# EAGLE design cubex_power (EAGLE 6.5.0)
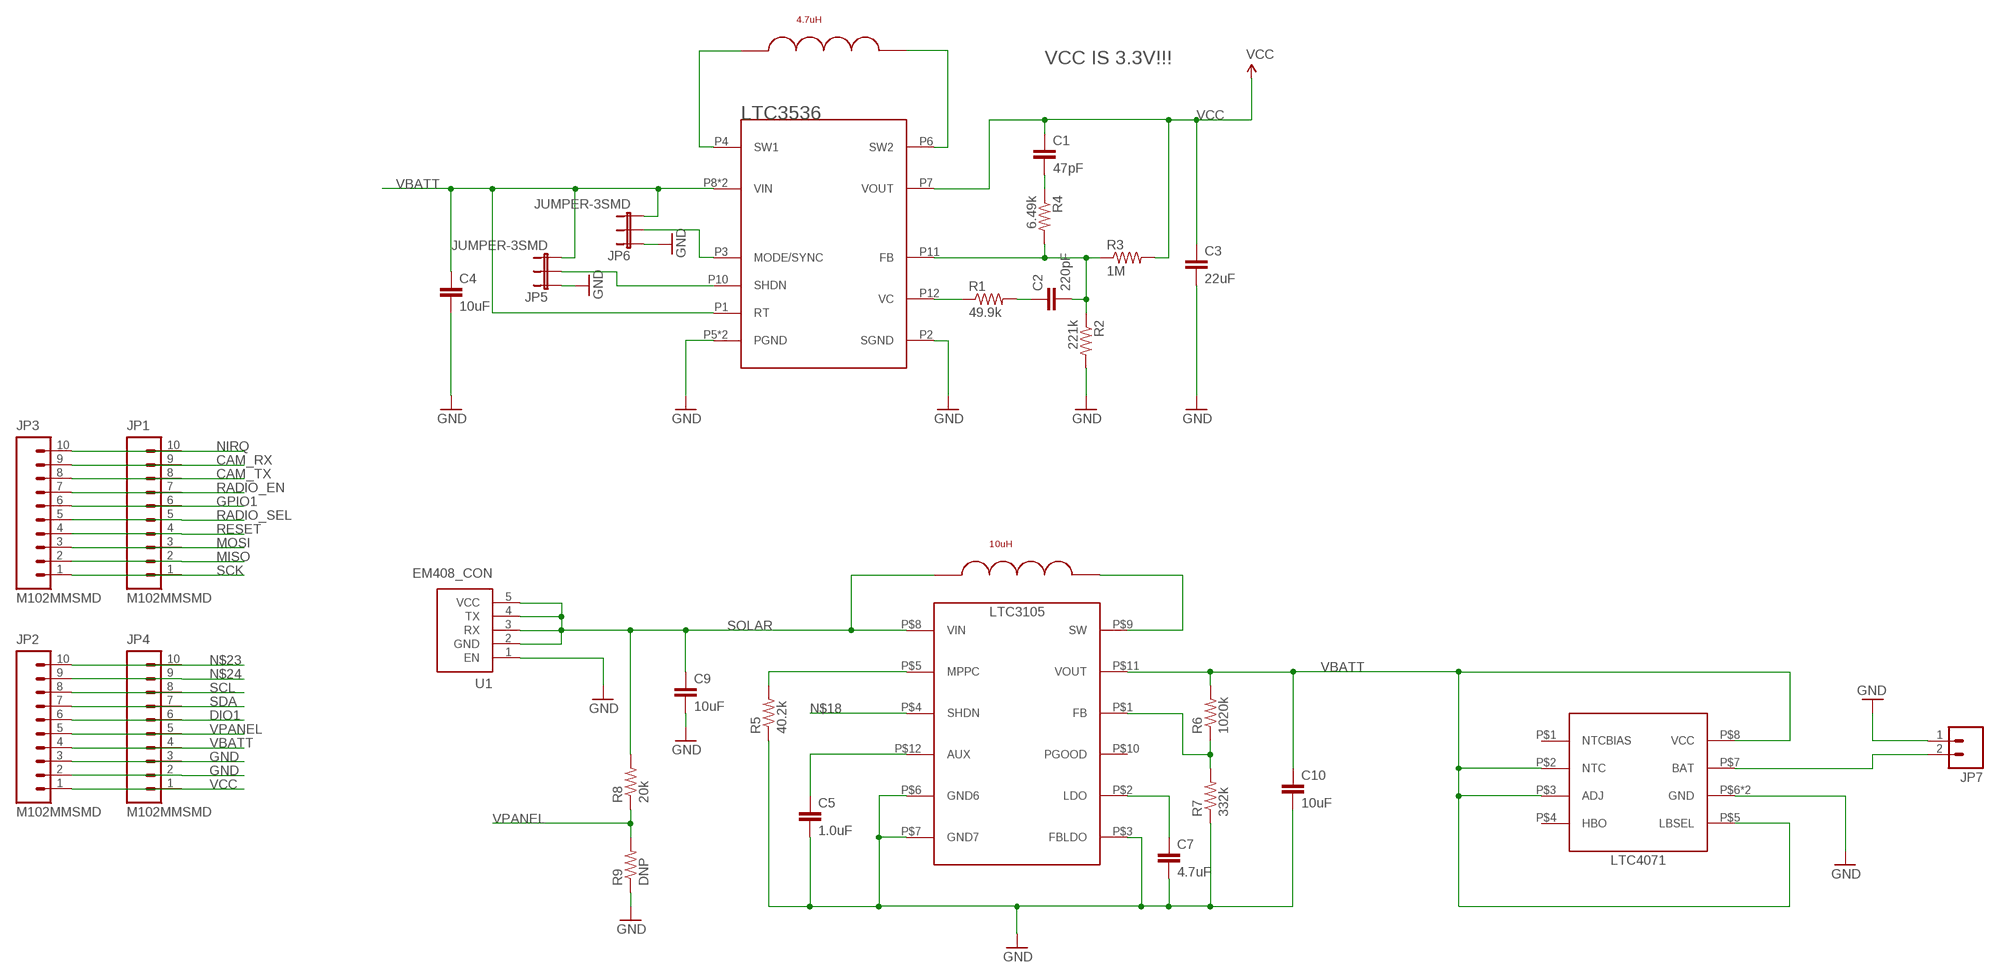
[diagram p0: schematic, sheet 1]

## Parts
C1  47pF  CAP1206  [1206]
C2  220pF  CAP1206  [1206]
C3  22uF  CAP1206  [1206]
C4  10uF  CAP1206  [1206]
C5  1.0uF  1.0UF-25V-+80/-20(0805)  [0805]
C7  4.7uF  CAP0805  [0805]
C9  10uF  CAP1206  [1206]
C10  10uF  CAP1206  [1206]
JP1  M102MMSMD  [1X10-2MM-SMD]
JP2  M102MMSMD  [1X10-2MM-SMD]
JP3  M102MMSMD  [1X10-2MM-SMD]
JP4  M102MMSMD  [1X10-2MM-SMD]
JP5  JUMPER-3SMD  [SJ_3]
JP6  JUMPER-3SMD  [SJ_3]
JP7  M02JST-PTH-2  [JST-2-PTH]
R1  49.9k  RESISTOR1206  [1206]
R2  221k  RESISTOR1206  [1206]
R3  1M  RESISTOR1206  [1206]
R4  6.49k  RESISTOR1206  [1206]
R5  40.2k  RESISTOR0805-RES  [0805]
R6  1020k  RESISTOR0805-RES  [0805]
R7  332k  RESISTOR0805-RES  [0805]
R8  20k  RESISTOR0805-RES  [0805]
R9  DNP  RESISTOR0805-RES  [0805]
U1  EM408_CON  [EM408_CON]
U$1  LTC3105  [LTC3105]
U$2  4.7uH  STEVESCOILCRAFT_COILCRAFT_LPS4018  [STEVESCOILCRAFT_COILCRAFT_LPS4018]
U$3  LTC3536  [LTC3536-MSE]
U$4  10uH  STEVESCOILCRAFT_COILCRAFT_LPS4018  [STEVESCOILCRAFT_COILCRAFT_LPS4018]
U$5  LTC4071  [LTC4071]

## Nets
CAM_RX: JP1.9 JP3.9
CAM_TX: JP1.8 JP3.8
DIO1: JP2.6 JP4.6
GND: C3.2 C4.2 C5.2 C7.2 C9.2 C10.2 JP2.2 JP2.3 JP4.2 JP4.3 JP5.1 JP6.1 JP7.1 R2.2 R5.1 R7.1 R9.1 U1.1(EN) U$1.P$3(FBLDO) U$1.P$6(GND6) U$1.P$7(GND7) U$3.P2(SGND) U$3.P5(PGND) U$3.P13(PGND) U$5.P$6(GND) U$5.P$9(GND)
GPIO1: JP1.6 JP3.6
MISO: JP1.2 JP3.2
MOSI: JP1.3 JP3.3
N$1: JP7.2 U$5.P$7(BAT)
N$2: U$2.P$2 U$3.P6(SW2)
N$3: U$2.P$1 U$3.P4(SW1)
N$4: C1.2 R4.1
N$6: C2.2 R2.1 R3.1 R4.2 U$3.P11(FB)
N$9: R1.1 U$3.P12(VC)
N$10: C2.1 R1.2
N$11: JP5.2 U$3.P10(SHDN)
N$14: JP6.2 U$3.P3(MODE/SYNC)
N$16: R5.2 U$1.P$5(MPPC)
N$17: C5.1 U$1.P$12(AUX)
N$18: U$1.P$4(SHDN)
N$19: R6.1 R7.2 U$1.P$1(FB)
N$22: C7.1 U$1.P$2(LDO)
N$23: JP2.10 JP4.10
N$24: JP2.9 JP4.9
N$26: U$1.P$9(SW) U$4.P$2
NIRQ: JP1.10 JP3.10
RADIO_EN: JP1.7 JP3.7
RADIO_SEL: JP1.5 JP3.5
RESET: JP1.4 JP3.4
SCK: JP1.1 JP3.1
SCL: JP2.8 JP4.8
SDA: JP2.7 JP4.7
SOLAR: C9.1 R8.2 U1.2(GND) U1.3(RX) U1.4(TX) U1.5(VCC) U$1.P$8(VIN) U$4.P$1
VBATT: C4.1 C10.1 JP2.4 JP4.4 JP5.3 JP6.3 R6.2 U$1.P$11(VOUT) U$3.P1(RT) U$3.P8(VIN) U$3.P9(VIN) U$5.P$2(NTC) U$5.P$3(ADJ) U$5.P$5(LBSEL) U$5.P$8(VCC)
VCC: C1.1 C3.1 JP2.1 JP4.1 R3.2 U$3.P7(VOUT)
VPANEL: JP2.5 JP4.5 R8.1 R9.2
Unconnected: U$1.P$10(PGOOD) U$5.P$1(NTCBIAS) U$5.P$4(HBO)

## Notes on the sheet
- VCC IS 3.3V!!!

## Library data of the parts
C1-C4 = SparkFun:CAP: Capacitor Standard 0603 ceramic capacitor, and 0.1" leaded capacitor.
C5 = SparkFun-Capacitors:1.0UF-25V-+80/-20(0805); PROD_ID: CAP-11625
C7 C9 C10 = SparkFun-Capacitors:CAP: Capacitor Standard 0603 ceramic capacitor, and 0.1" leaded capacitor.
JP1-JP4 = SparkFun:M10: Header 10 Standard 10-pin 0.1" header. Use with straight break away headers (SKU : PRT-00116), right angle break away headers (PRT-00553), swiss pins (PRT-00743), machine pins (PRT-00117), and female headers (PRT-00115).
JP5 JP6 = SparkFun:JUMPER-3
JP7 = SparkFun:M02: Header 2 Standard 2-pin 0.1" header. Use with straight break away headers (SKU : PRT-00116), right angle break away headers (PRT-00553), swiss pins (PRT-00743), machine pins (PRT-00117), and female headers (PRT-00115). Molex polarized connector foot print use with SKU : PRT-08233 with associated crimp pins and housings.
R1-R4 = SparkFun:RESISTOR: Resistor Basic schematic elements and footprints for 0603, 1206, and PTH resistors.
R5-R9 = SparkFun-Resistors:RESISTOR: Resistor Basic schematic elements and footprints for 0603, 1206, and PTH resistors.
U1 = SparkFun:EM408_CON: This is the mating connector for the EM408 GPS receiver. The EM408 connects to the board via a cable, this connector footprint does not include the outline of the receiver. You should include the "EM408_Outline" device in your schematic if you are to use the EM408 in your design.
U$1 = arko:LTC3105
U$2 U$4 = picoAVA-R9:STEVESCOILCRAFT_COILCRAFT_LPS4018: CoilCraft LPS4018 series inductor
U$3 = arko:LTC3536
U$5 = arko:LTC4071

## Board
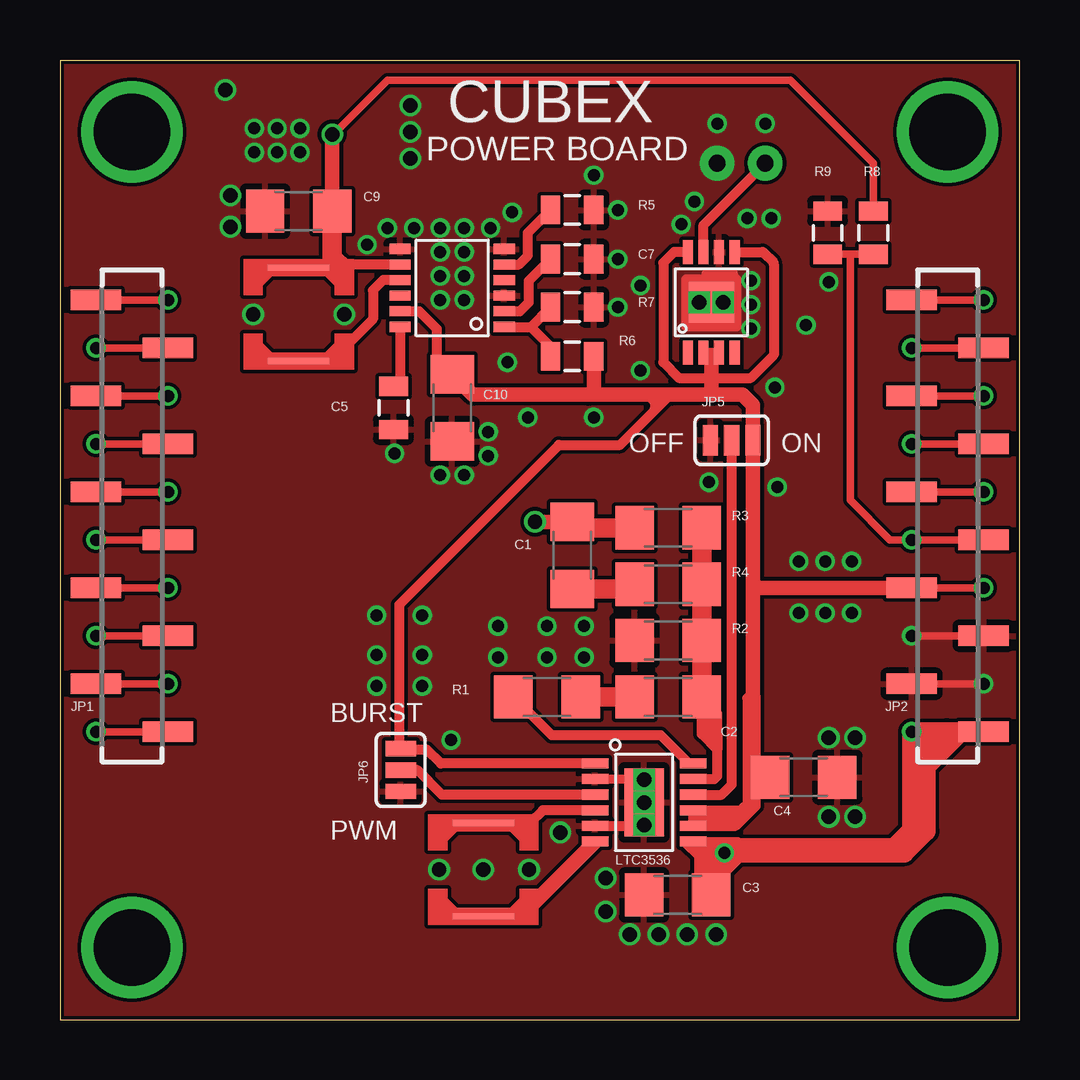
[diagram p1: board, top side]
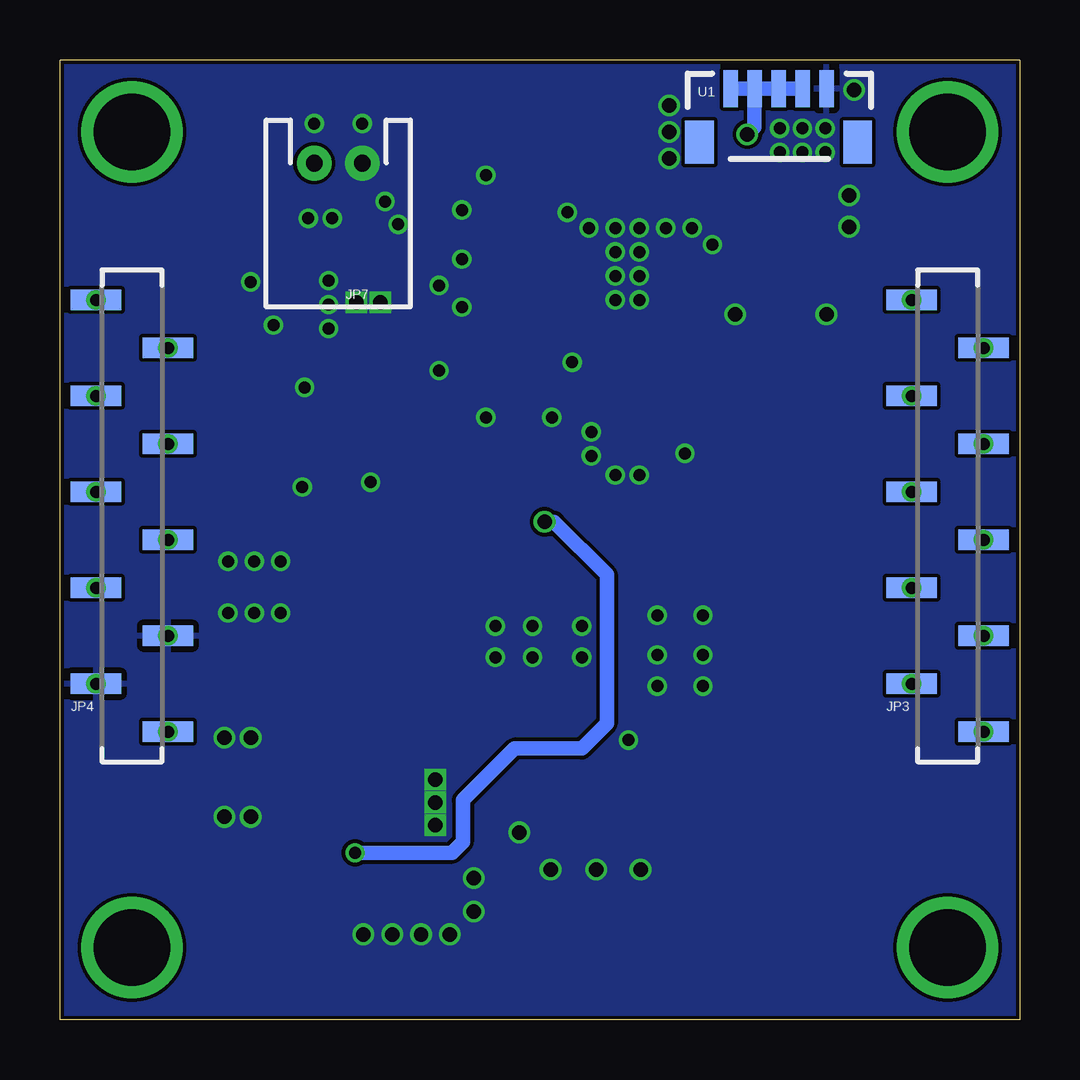
[diagram p2: board, bottom side, seen from below]

Size 40 x 40 mm. Coordinates in mm from the lower left corner, seen from the top.
Outline: 0,0 40,0 40,40 0,40 0,0
Copper layers (1*16): Top 0.035mm / dielectric 1.5mm / Bottom 0.035mm
Design rules "hackvana": minimum track width 6mil, minimum drill 0.3mm, track to track 6mil, track to pad 6mil, pad to pad 6mil, via to via 6mil, smd to smd 0mil, copper to edge 6mil, drill to drill 6mil, minimum pad ring 10mil, minimum via ring 6mil, stop-mask expansion 2mil, vias tented up to drill 100mil, thermal gap 10mil

### Footprints (pad centres in the part's own frame; a part is rotated, then mirrored left to right if it is on the bottom)
1206 = smd 1.6 x 1.8: 1 -1.4,0; 2 1.4,0
0805 = smd 0.8 x 1.2: 1 -0.9,0; 2 0.9,0
1X10-2MM-SMD = smd 0.85 x 2.1: 1 0,-1.5; 2 2,1.5; 3 4,-1.5; 4 6,1.5; 5 8,-1.5; 6 10,1.5; 7 12,-1.5; 8 14,1.5; 9 16,-1.5; 10 18,1.5
SJ_3 = smd 0.635 x 1.27: 1 -0.889,0; 2 0,0; 3 0.889,0
JST-2-PTH = drill 0.7 pad 1.448: 1 -1,0; 2 1,0
EM408_CON = smd 0.6 x 1.55: 1 4,0; 2 3,0; 3 2,0; 4 1,0; 5 0,0 | smd 1.2 x 1.8: P$1 -1.3,-2.225; P$2 5.3,-2.225
LTC3105 = smd 0.42 x 0.889: P$1 -1.625,-2.171; P$2 -0.975,-2.171; P$3 -0.325,-2.171; P$4 0.325,-2.171; P$5 0.975,-2.171; P$6 1.625,-2.171; P$7 1.625,2.171; P$8 0.975,2.171; P$9 0.325,2.171; P$10 -0.325,2.171; P$11 -0.975,2.171; P$12 -1.625,2.171
STEVESCOILCRAFT_COILCRAFT_LPS4018 = smd 0.254 x 2.54: P$1 -1.95,0; P$2 1.95,0
LTC3536-MSE = smd 0.42 x 1.1: P1 -1.625,-2.045; P2 -0.975,-2.045; P3 -0.325,-2.045; P4 0.325,-2.045; P5 0.975,-2.045; P6 1.625,-2.045; P7 1.625,2.045; P8 0.975,2.045; P9 0.325,2.045; P10 -0.325,2.045; P11 -0.975,2.045; P12 -1.625,2.045 | smd 2.845 x 1.651: P13 0,0
LTC4071 = smd 0.42 x 1: P$1 -0.975,-2.1; P$2 -0.325,-2.1; P$3 0.325,-2.1; P$4 0.975,-2.1; P$5 0.975,2.1; P$6 0.325,2.1; P$7 -0.325,2.1; P$8 -0.975,2.1 | smd 1.88 x 1.68: P$9 0,0

### Placement (x,y rotation side)
C1  21.35,19.35 270 top
C2  25.35,13.45 0 top
C3  25.75,5.2 180 top
C4  31,10.1 0 top
C5  13.9,25.5 270 top
C7  21.35,31.7 0 top
C9  9.95,33.7 180 top
C10  16.35,25.5 270 top
JP1  3,12 90 top
JP2  37,12 90 top
JP3  3,12 90 bottom
JP4  37,12 90 bottom
JP5  28,24.15 0 top
JP6  14.2,10.4 90 top
JP7  28.4,35.7 180 bottom
R1  20.3,13.45 0 top
R2  25.35,15.8 180 top
R3  25.35,20.5 180 top
R4  25.35,18.15 0 top
R5  21.35,33.75 180 top
R6  21.35,27.65 0 top
R7  21.35,29.7 180 top
R8  33.9,32.8 90 top
R9  32,32.8 270 top
U1  12.05,38.8 0 bottom
U$1  16.35,30.5 90 top
U$2  17.65,6.25 270 top
U$3  24.35,9.05 270 top
U$4  9.95,29.4 270 top
U$5  27.15,29.9 0 top

### Tracks (layer width: path | path; a pad name or v marks a point on that pad's centre or on a via)
CAM_RX  (via drill 0.5)
  Top 0.305: JP1.9 JP3.9
  other vias: 1.5,28
CAM_TX  (via drill 0.5)
  Top 0.305: JP1.8 JP3.8
  other vias: 4.5,26
DIO1  (via drill 0.5)
  Top 0.305: JP2.6 JP4.6
  other vias: 38.5,22
GND  (via drill 0.5, 0.6)
  Top 0.254: 22.25,8.1 22.3,8.1 | 22.3,8.1 22.4,8.1 | U$3.P5 22.3,8.1
  Top 0.305: JP2.2 JP4.2 | JP2.3 JP4.3 | 22.2,10 22.33,10 | 22.35,10 22.85,10 | 23.7,10 22.85,10 | 22.85,10 22.8,10.05 | 22.8,10.05 24.1,10.05 24.35,10.05 | 22.8,10.05 22.4,10.05 22.35,10 | 22.35,10 22.33,10 | 22.33,10 U$3.P2
  Top 0.406: 24.3,10 v24.35,10 24.05,10 | U$3.P5 24.35,8.07 v24.35,8.1 | 23.9,10 24.05,10 | 24.05,10 24.1,10.05 | 26.3,30.85 26.1,30.85 26.1,28.9 28.2,28.9 28.2,30.85 28.05,30.85 | 28.05,30.85 26.4,30.85 26.65,30.6 v26.65,29.9 | 26.95,31.1 28.05,31.1 28.05,30.85
  other vias: 38.5,14 35.5,16 24.35,9.05 32.05,11.75 33.15,11.75 33.15,8.45 32.05,8.45 22.75,5.9 22.75,4.5 23.75,3.55 24.95,3.55 26.15,3.55 27.35,3.55 20.85,7.8 19.55,6.25 17.65,6.25 15.8,6.25 31.9,16.95 30.8,16.95 26.45,34.1 33,16.95 20.3,16.4 21.85,16.4 21.85,15.1 20.3,15.1 29.9,22.2 16.85,33 15.85,33 16.85,31 24.2,27.05 16.85,32 28.65,33.4 29.65,33.4 25.9,33.15 14.6,35.9 14.6,38.1 14.6,37 6.9,38.75 7.1,34.35 7.1,33.05 8.05,29.4 11.85,29.4 8.1,37.15 9.05,37.15 10,37.15 10,36.15 9.05,36.15 8.1,36.15 15.85,30 16.85,30 14.75,33 15.85,31 12.8,32.3 15.85,32 30.8,19.1 31.9,19.1 33,19.1 22.25,25.1 23.25,33.75 15.85,22.7 17.95,33 18.65,27.4 19.5,25.1 13.95,23.6 17.85,23.5 17.85,24.5 16.85,22.7 18.85,33.65 13.65,33 23.25,29.7 23.25,31.7 15.1,15.2 13.2,15.2 27.65,29.9 13.2,13.9 13.2,16.85 15.1,16.85 15.1,13.9 16.3,11.65 18.25,15.1 18.25,16.4 27.05,22.4 29.8,26.35 31.1,28.95 32.05,30.75 29.4,37.35 27.4,37.35 22.25,35.2 24.2,30.6 28.8,29.8 28.8,28.8 28.8,30.8
  pour Top: 0,40 40,40 40,0 0,0
  pour Bottom: 0,40 40,40 40,0 0,0
GPIO1  (via drill 0.5)
  Top 0.305: JP1.6 JP3.6
  other vias: 4.5,22
MISO  (via drill 0.5)
  Top 0.305: JP1.2 JP3.2
  other vias: 4.5,14
MOSI  (via drill 0.5)
  Top 0.305: JP1.3 JP3.3
  other vias: 1.5,16
N$1
  Top 0.406: U$5.P$7 26.82,33.12 JP7.2
N$2
  Top 0.254: 22.45,7.4 22.33,7.4 U$3.P6
  Top 0.406: U$3.P6 22.18,7.42 19.8,5.05 19.65,5.05 19.5,4.9 19.5,4.35 19.45,4.3 U$2.P$2 | 22.45,7.4 19.7,4.65
N$3
  Top 0.406: U$3.P4 20.12,8.72 19.6,8.2 U$2.P$1
N$4
  Top 0.813: C1.2 23.75,17.95 R4.1
N$5  (via drill 3.2)
  other vias: 3,3
N$6
  Top 0.406: U$3.P11 27.27,10.03 27.4,10.15 27.4,11.25 | 27.4,11.25 26.75,11.9 | 26.75,11.9 27.4,11.9 | 27.4,11.9 27.4,11.25 | 27.05,12.8 27.05,12.2 27.2,12.05 26.9,12.05 26.75,11.9 | 26.75,11.9 C2.2 | 27.4,11.9 27.4,12.45 | 27.4,12.45 27.4,12.75 27.35,12.8 27.05,12.8 | 27.4,12.45 27.05,12.8
  Top 0.813: C2.2 R2.1 R4.2 R3.1
N$7  (via drill 3.2)
  other vias: 37,3
N$8  (via drill 3.2)
  other vias: 37,37
N$9
  Top 0.406: R1.1 20.5,11.85 25.05,11.85 26.23,10.68 U$3.P12
N$10
  Top 0.813: R1.2 C2.1
N$11
  Top 0.406: U$3.P10 27.57,9.38 28,9.8 JP5.2
N$12  (via drill 3.2)
  other vias: 3,37
N$14
  Top 0.406: U$3.P3 15.93,9.38 14.9,10.4 JP6.2
N$16
  Top 0.406: U$1.P$5 19.12,31.48 19.5,31.85 19.5,32.8 R5.2
N$17
  Top 0.406: U$1.P$12 14.18,26.68 C5.1
N$19
  Top 0.406: U$1.P$1 19.62,28.88 | 19.62,28.88 R7.2 | R6.1 20.45,28.05 19.62,28.88
N$22
  Top 0.406: U$1.P$2 19.18,29.52 19.55,29.9 19.55,30.8 C7.1
N$23  (via drill 0.5)
  Top 0.305: JP2.10 JP4.10
  other vias: 38.5,30
N$24  (via drill 0.5)
  Top 0.305: JP2.9 JP4.9
  other vias: 35.5,28
N$26
  Top 0.406: U$1.P$9 13.47,30.82 13.05,30.4 13.05,29.2 11.4,27.55 10.05,27.55 U$4.P$2
NIRQ  (via drill 0.5)
  Top 0.305: JP1.10 JP3.10
  other vias: 4.5,30
RADIO_EN  (via drill 0.5)
  Top 0.305: JP1.7 JP3.7
  other vias: 1.5,24
RADIO_SEL  (via drill 0.5)
  Top 0.305: JP1.5 JP3.5
  other vias: 1.5,20
RESET  (via drill 0.5)
  Top 0.305: JP1.4 JP3.4
  other vias: 4.5,18
SCK  (via drill 0.5)
  Top 0.305: JP1.1 JP3.1
  other vias: 1.5,12
SCL  (via drill 0.5)
  Top 0.305: JP2.8 JP4.8
  other vias: 38.5,26
SDA  (via drill 0.5)
  Top 0.305: JP2.7 JP4.7
  other vias: 35.5,24
SOLAR  (via drill 0.6)
  Top 0.305: v11.35,36.9 11.4,36.9 13.65,39.15 30.45,39.15 33.9,35.7 R8.2
  Top 0.406: U$1.P$8 11.65,31.48 10.07,31.48 U$4.P$1
  Top 0.61: v11.35,36.9 C9.1
  Top 0.813: C9.1 11.35,31.77 11.65,31.48
  Bottom 0.61: U1.2 U1.3 U1.4 | U1.4 U1.5 | U1.4 11.05,37.2 v11.35,36.9
VBATT  (via drill 0.5)
  Top 0.305: JP2.4 JP4.4 | U$5.P$5 29.25,32 29.75,31.5
  Top 0.406: 28.8,8.7 28.18,8.07 U$3.P8 U$3.P9 28.77,8.72 28.8,8.7 | 28.8,8.7 26.85,8.7 26.6,8.45 28.35,8.45 28.4,8.5 28.6,8.5 29,8.9 29,10.1 | 29,10.1 29,13.45 28.85,13.45 28.7,13.45 28.65,13.4 28.65,9 28.45,8.8 28.65,8.8 28.9,9.05 28.9,10 | 28.9,10 28.9,13.25 28.85,13.3 | 14.24,11.25 15.3,11.25 15.88,10.68 U$3.P1 | 14.24,11.25 JP6.3 | 14.24,11.25 14.15,11.25 14.15,17.3 20.8,23.95 23.35,23.95 25.45,26.05 | 28.9,10 29,10.1 | 29,10.1 C4.1 | U$1.P$11 14.97,29.52 15.7,28.8 15.7,27.55 C10.1 | 24.65,25.9 24.85,25.7 | 24.85,25.7 24.8,25.7 24.8,25.45 | 24.85,25.7 25.2,26.05 25.15,26.1 | U$5.P$8 25.6,32 25.15,31.55 25.15,27.4 25.8,26.75 27.15,26.75 28.8,26.75 29.75,27.7 29.75,31.5 | 27.15,27.45 27.48,27.77 U$5.P$3 U$5.P$2 27,27.8 27.15,27.65 | U$5.P$5 29.3,32 29.75,31.55
  Top 0.61: 28.89,18.2 JP5.3 28.89,25.61 28.45,26.05 27.2,26.05 | 28.89,18.2 28.89,13.49 28.85,13.45 | JP2.4 29.09,18 28.89,18.2 | 27.2,26.05 25.45,26.05 25.2,26.05 22.05,26.05 | 22.05,26.05 17.2,26.05 C10.1 | R6.2 22.25,26.25 22.05,26.05 | 27.15,27.65 27.15,26.75 27.15,26.1 27.2,26.05
  other vias: 38.5,18
VCC  (via drill 0.5, 0.6)
  Top 0.305: v27.7,6.95 27.7,7.35 27.75,7.4
  Top 0.406: 26.85,7.05 26.9,7.05 26.9,7.35 26.95,7.4 27.75,7.4 28.25,7.4 28.45,7.2 28.45,7.15 28.35,7.05 | 26.85,7.05 26.77,7.05 U$3.P7 | 26.85,7.05 26.85,6.8 26.65,6.6 26.65,6.8 26.1,7.35 26.75,7.35 27.2,6.9
  Top 0.61: 28.35,7.05 27.5,7.05 26.9,7.05 26.9,7.3 | C1.1 v19.8,20.75
  Top 0.813: 27.5,6.2 27.5,7.05 | 26.85,7.05 26.85,5.6 27,5.6 27,5.2 C3.1 27.5,5.2 27.5,6.2 | 27.5,6.2 28.3,7 27.4,7 27.35,6.95 | C1.1 21.6,20.5 R3.2 | 28.35,7.05 28.15,7.05 28.05,7.15 34.75,7.15 35.5,7.9 JP4.1 | 27.75,6.95 35.2,6.95 36.1,7.85 36.1,11.4 JP4.1 | JP4.1 36.95,12 | 36.95,12 37.55,12 | 37.55,12 36.15,10.6 36.15,11.25 36.5,11.6 36.55,11.6 36.95,12 | 37.55,12 JP2.1
  Bottom 0.61: v27.7,6.95 23.65,6.95 23.2,7.4 23.2,9.15 21.05,11.3 18.25,11.3 17.2,12.35 17.2,18.55 19.4,20.75 v19.8,20.75
  other vias: 35.5,12
VPANEL  (via drill 0.5)
  Top 0.305: JP2.5 JP4.5 34.6,20 32.95,21.65 32.95,31.9 | 32.95,31.9 R9.2 | R8.1 32.95,31.9
  other vias: 35.5,20

### Text on the board
tNames: CUBEX | POWER BOARD | OFF | ON | BURST | PWM